# Altium project AnalogProje.PrjPcb
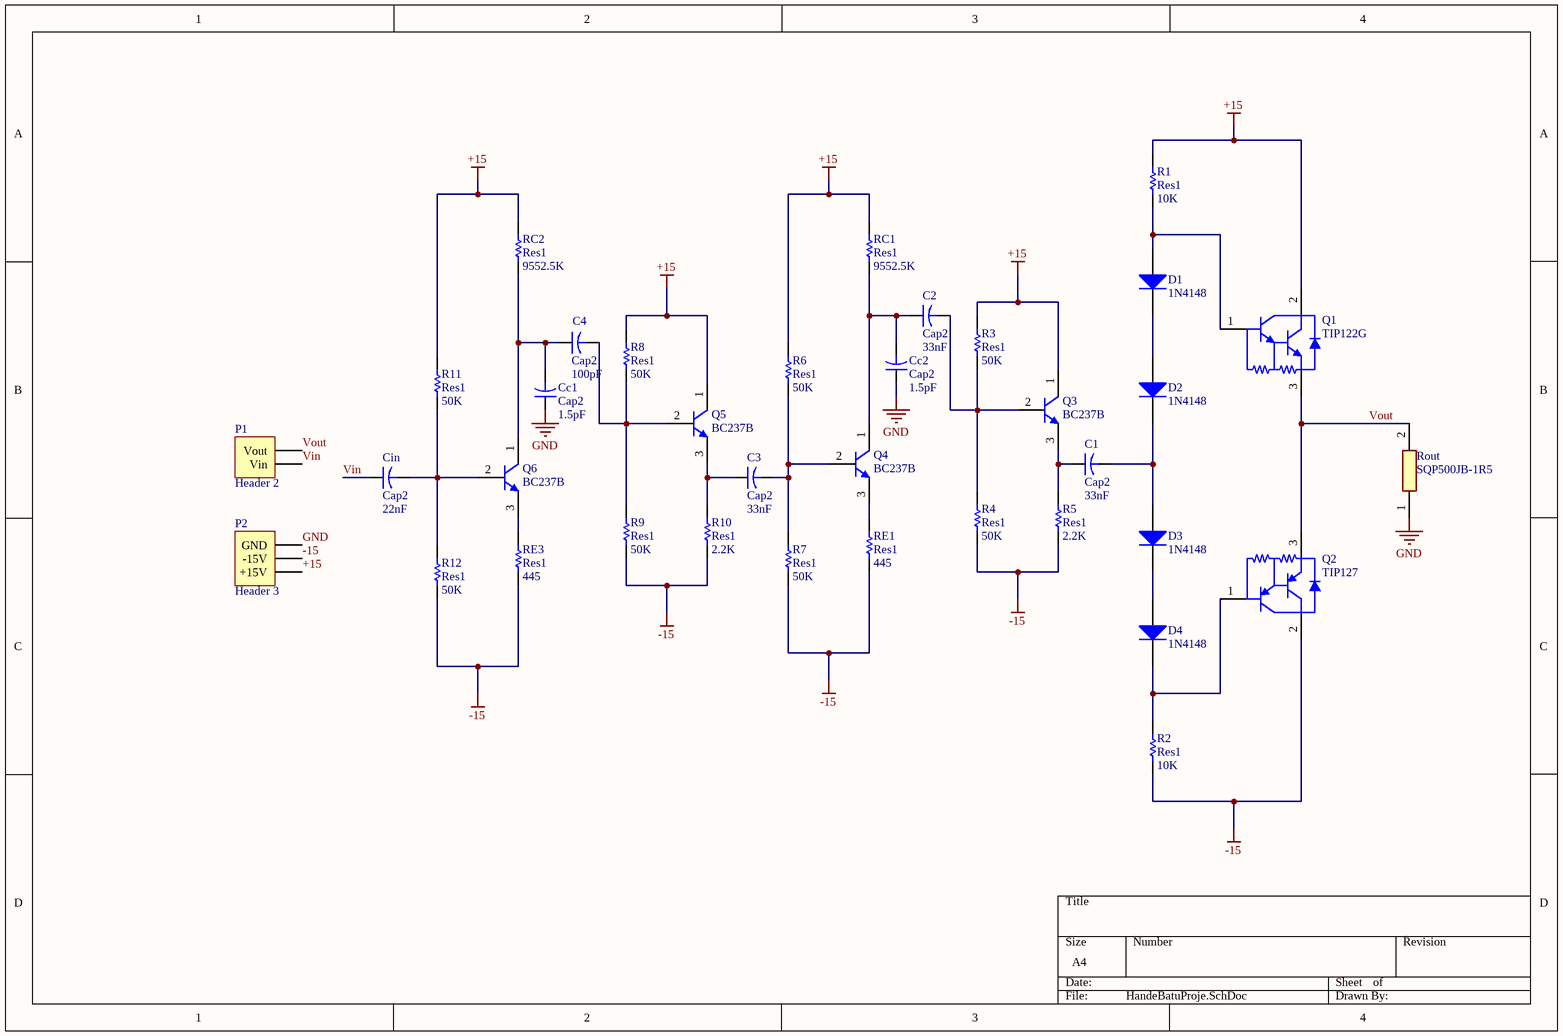
[diagram p0: HandeBatuProje.SchDoc]
1 sheet, 36 parts. Net scope: global (net labels, ports and power ports of the same name join across sheets).
Board file: PCBProje (1).PcbDoc

## Sheet HandeBatuProje.SchDoc
size A4

### Parts
C1  Cap2  value 33nF  [CAPR5-4X5]
C2  Cap2  value 33nF  [CAPR5-4X5]
C3  Cap2  value 33nF  [CAPR5-4X5]
C4  Cap2  value 100pF  [CAPR5-4X5]
Cc1  Cap2  value 1.5pF  [CAPR5-4X5]
Cc2  Cap2  value 1.5pF  [CAPR5-4X5]
Cin  Cap2  value 22nF  [CAPR5-4X5]
D1  1N4148  [NXP-SOD27-2_V]
D2  1N4148  [NXP-SOD27-2_V]
D3  1N4148  [NXP-SOD27-2_V]
D4  1N4148  [NXP-SOD27-2_V]
P1  Header 2  [HDR1X2]
P2  Header 3  [HDR1X3]
Q1  TIP122G  [ONSC-TO-220-3-221A-09]
Q2  TIP127  [ONSC-TO-220-3-221A-09]
Q3  BC237B  [ONSC-TO-92-3-29-11]
Q4  BC237B  [ONSC-TO-92-3-29-11]
Q5  BC237B  [ONSC-TO-92-3-29-11]
Q6  BC237B  [ONSC-TO-92-3-29-11]
R1  Res1  value 10K  [AXIAL-0.3]
R2  Res1  value 10K  [AXIAL-0.3]
R3  Res1  value 50K  [AXIAL-0.3]
R4  Res1  value 50K  [AXIAL-0.3]
R5  Res1  value 2.2K  [AXIAL-0.3]
R6  Res1  value 50K  [AXIAL-0.3]
R7  Res1  value 50K  [AXIAL-0.3]
R8  Res1  value 50K  [AXIAL-0.3]
R9  Res1  value 50K  [AXIAL-0.3]
R10  Res1  value 2.2K  [AXIAL-0.3]
R11  Res1  value 50K  [AXIAL-0.3]
R12  Res1  value 50K  [AXIAL-0.3]
RC1  Res1  value 9552.5K  [AXIAL-0.3]
RC2  Res1  value 9552.5K  [AXIAL-0.3]
RE1  Res1  value 445  [AXIAL-0.3]
RE3  Res1  value 445  [AXIAL-0.3]
Rout  SQP500JB-1R5  [RESAD6000W85L2200D950]

### Nets
+15: P2.1(+15V) Q1.2(C) Q3.1(C) Q5.1(C) R1.1 R3.1 R6.1 R8.1 R11.1 RC1.1 RC2.1
-15: P2.2(-15V) Q2.2(C) R2.2 R4.2 R5.2 R7.2 R9.2 R10.2 R12.2 RE1.2 RE3.2
GND: Cc1.1 Cc2.1 P2.3(GND) Rout.1
Vin: Cin.1 P1.1(Vin)
Vout: P1.2(Vout) Q1.3(E) Q2.3(E) Rout.2
NetC1_1: C1.1 Q3.3(E) R5.1
NetC1_2: C1.2 D2.2(K) D3.1(A)
NetC2_1: C2.1 Cc2.2 Q4.1(C) RC1.2
NetC2_2: C2.2 Q3.2(B) R3.2 R4.1
NetC3_1: C3.1 Q5.3(E) R10.1
NetC3_2: C3.2 Q4.2(B) R6.2 R7.1
NetC4_1: C4.1 Cc1.2 Q6.1(C) RC2.2
NetC4_2: C4.2 Q5.2(B) R8.2 R9.1
NetCin_2: Cin.2 Q6.2(B) R11.2 R12.1
NetD1_1: D1.1(A) Q1.1(B) R1.2
NetD1_2: D1.2(K) D2.1(A)
NetD3_2: D3.2(K) D4.1(A)
NetD4_2: D4.2(K) Q2.1(B) R2.1
NetQ4_3: Q4.3(E) RE1.1
NetQ6_3: Q6.3(E) RE3.1

### Library data of the parts
C1-C4 Cc1 Cc2 Cin = Cap2: Capacitor; Published: 23-Sep-2002; PackageReference: CAPR5-4X5; Publisher: Altium Limited; PackageDescription: Capacitor; 2 Leads
D1-D4 = CMP-0648-00002-1: High-speed Diode, 100 V, 450 mA, 2-Pin SOD27, RoHS; Manufacturer: NXP Semiconductors; Configuration: Single; IR (VR: 20 V)=25 nA; IFRM: 450 mA; IFSM: 4 A Max.; Trr: 4 ns Max.; Cd: 4 pF Max.; VR: 100 V Max.; VF (IF: 10 mA)=1 V; IF: 200 mA Max.; ComponentLink1Description: Manufacturer URL; RoHS: TRUE; ComponentLink1URL: http://www.nxp.com/; ComponentLink3Description: Package Specification; DatasheetVersion: Aug-04; ComponentLink2Description: Datasheet; PackageVersion: Aug-04; PackageReference: SOD27; ComponentLink3URL: http://www.nxp.com/documents/data_sheet/1N4148_1N4448.pdf; Mounting Technology: Through Hole; ComponentLink2URL: http://www.nxp.com/documents/data_sheet/1N4148_1N4448.pdf; PartNumber: 1N4148; PackageDescription: 2-Pin Hermetically Sealed Glass Package, Axial Leaded, Dia 1.85 mm, Body Length 4.25 mm, Lead Spread 25.4 mm
P1 = Header 2: Header, 2-Pin; LatestRevisionDate: 17-Jul-2002; LatestRevisionNote: Re-released for DXP Platform.; Publisher: Altium Limited
P2 = Header 3: Header, 3-Pin; LatestRevisionDate: 17-Jul-2002; LatestRevisionNote: Re-released for DXP Platform.; Publisher: Altium Limited
Q1 = CMP-1047-00127-1: Plastic Medium-Power, Complementary Silicon Transistor, 3-Pin TO-220, Pb-Free, Tube; Manufacturer: On Semiconductor; Polarity: NPN; IC Continuous (A): 5; Packing: Tube; ComponentLink1Description: Manufacturer URL; ComponentLink2Description: Datasheet; ComponentLink1URL: http://www.onsemi.com/; PartNumber: TIP122G; PackageReference: TO-220-3-221A-09; DatasheetVersion: Rev. 8; PackageVersion: Rev. AG, 09/2011; ComponentLink3URL: http://www.onsemi.com/pub_link/Collateral/221A-09.PDF; PackageDescription: 3-Pin Flange Mount, Vertical Straight Lead, Body 9.97 x 4.445 mm, Pitch 2.54 mm; Mounting Technology: Through Hole; ComponentLink2URL: http://www.onsemi.cn/pub_link/Collateral/TIP120-D.PDF; RoHS: TRUE; ComponentLink3Description: Package Specification
Q2 = CMP-1031-00026-1: Plastic Medium-Power, Complementary Silicon Transistor, 3-Pin TO-220, Tube; Manufacturer: On Semiconductor; Polarity: PNP; IC Continuous (A): 5; ComponentLink2Description: Datasheet; ComponentLink3URL: http://www.onsemi.com/pub_link/Collateral/221A-09.PDF; PackageVersion: Rev. AG, 09/2011; RoHS: FALSE; DatasheetVersion: Rev. 8; ComponentLink3Description: Package Specification; ComponentLink1URL: http://www.onsemi.com/; Mounting Technology: Through Hole; Packing: Tube; PackageReference: TO-220-3-221A-09; PackageDescription: 3-Pin Flange Mount, Vertical Straight Lead, Body 9.97 x 4.445 mm, Pitch 2.54 mm; ComponentLink2URL: http://www.onsemi.cn/pub_link/Collateral/TIP120-D.PDF; PartNumber: TIP127; ComponentLink1Description: Manufacturer URL
Q3-Q6 = CMP-1048-01445-1: Amplifier Transistor, NPN Silicon, 3-Pin TO-92, Bulk Box; Manufacturer: On Semiconductor; Note1: 0; IC Continuous (A): 0.1; Mounting Technology: Through Hole; ComponentLink2Description: Datasheet; ComponentLink1URL: http://www.onsemi.com/; ComponentLink2URL: http://www.onsemi.com/pub_link/Collateral/BC237-D.PDF; DatasheetVersion: Rev. 5; ComponentLink3URL: http://www.onsemi.cn/pub_link/Collateral/2N6426-D.PDF; Polarity: NPN; PartNumber: BC237B; PackageReference: TO-92-3-29-11_AM_SL; PackageDescription: 3-Pin Transistor Outline, Body 4.825 x 3.685 mm, Pitch 1.27 mm; ComponentLink3Description: Package Specification; Packing: Bulk Box; PackageVersion: Rev. AM; ComponentLink1Description: Manufacturer URL; RoHS: FALSE
R1-R12 RC1 RC2 RE1 RE3 = Res1: Resistor; Published: 8-Jun-2000; LatestRevisionDate: 17-Jul-2002; LatestRevisionNote: Re-released for DXP Platform.; PackageReference: AXIAL-0.3; Publisher: Altium Limited; PackageDescription: Axial Device, Thru-Hole; 2 Leads; 0.3 in Pin Spacing
Rout = SQP500JB-1R5: Resistor; Manufacturer_Name: YAGEO (PHYCOMP); Datasheet Link: http://www.yageo.com/NewPortal/yageo?service=throughHole&layer2=Wirewound&lang=en; Manufacturer_Part_Number: SQP500JB-1R5; Mouser Part Number: 603-SQP500JB-1R5; Mouser Price/Stock: https://www.mouser.com/Search/Refine.aspx?Keyword=603-SQP500JB-1R5